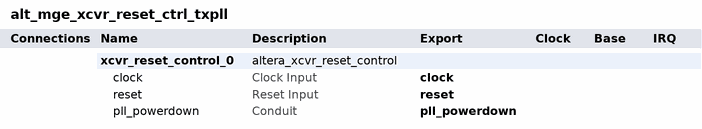
[diagram p0: system contents]
# Platform Designer (Qsys) system alt_mge_xcvr_reset_ctrl_txpll, Arria 10 10AX115S4F45I3SGES
# Parameters at their usual value, and those the tool derives, are not listed.
package require -exact qsys 14.1
create_system alt_mge_xcvr_reset_ctrl_txpll
set_project_property DEVICE_FAMILY {Arria 10}
set_project_property DEVICE 10AX115S4F45I3SGES

add_instance xcvr_reset_control_0 altera_xcvr_reset_control 14.1
set_instance_property xcvr_reset_control_0 AUTO_EXPORT true
set_instance_parameter_value xcvr_reset_control_0 CHANNELS 1
set_instance_parameter_value xcvr_reset_control_0 PLLS 2
set_instance_parameter_value xcvr_reset_control_0 RX_ENABLE 0
set_instance_parameter_value xcvr_reset_control_0 RX_PER_CHANNEL 0
set_instance_parameter_value xcvr_reset_control_0 SYNCHRONIZE_PLL_RESET 1
set_instance_parameter_value xcvr_reset_control_0 SYS_CLK_IN_MHZ 125
set_instance_parameter_value xcvr_reset_control_0 TX_ENABLE 0
set_instance_parameter_value xcvr_reset_control_0 TX_PLL_ENABLE 1
set_instance_parameter_value xcvr_reset_control_0 T_RX_ANALOGRESET 40
set_instance_parameter_value xcvr_reset_control_0 T_TX_DIGITALRESET 20
set_instance_parameter_value xcvr_reset_control_0 gui_pll_cal_busy 0

# exported interfaces
add_interface clock clock sink
set_interface_property clock EXPORT_OF xcvr_reset_control_0.clock
add_interface pll_powerdown conduit end
set_interface_property pll_powerdown EXPORT_OF xcvr_reset_control_0.pll_powerdown
add_interface reset reset sink
set_interface_property reset EXPORT_OF xcvr_reset_control_0.reset

set_interconnect_requirement {$system} qsys_mm.clockCrossingAdapter HANDSHAKE
set_interconnect_requirement {$system} qsys_mm.insertDefaultSlave FALSE
set_interconnect_requirement {$system} qsys_mm.maxAdditionalLatency 1

save_system alt_mge_xcvr_reset_ctrl_txpll.qsys
